# Altium schematic sheet 10.RK3568_PowerGND.SchDoc
size 297 x 209 mm; SheetNumber: 1; SheetTotal: 11
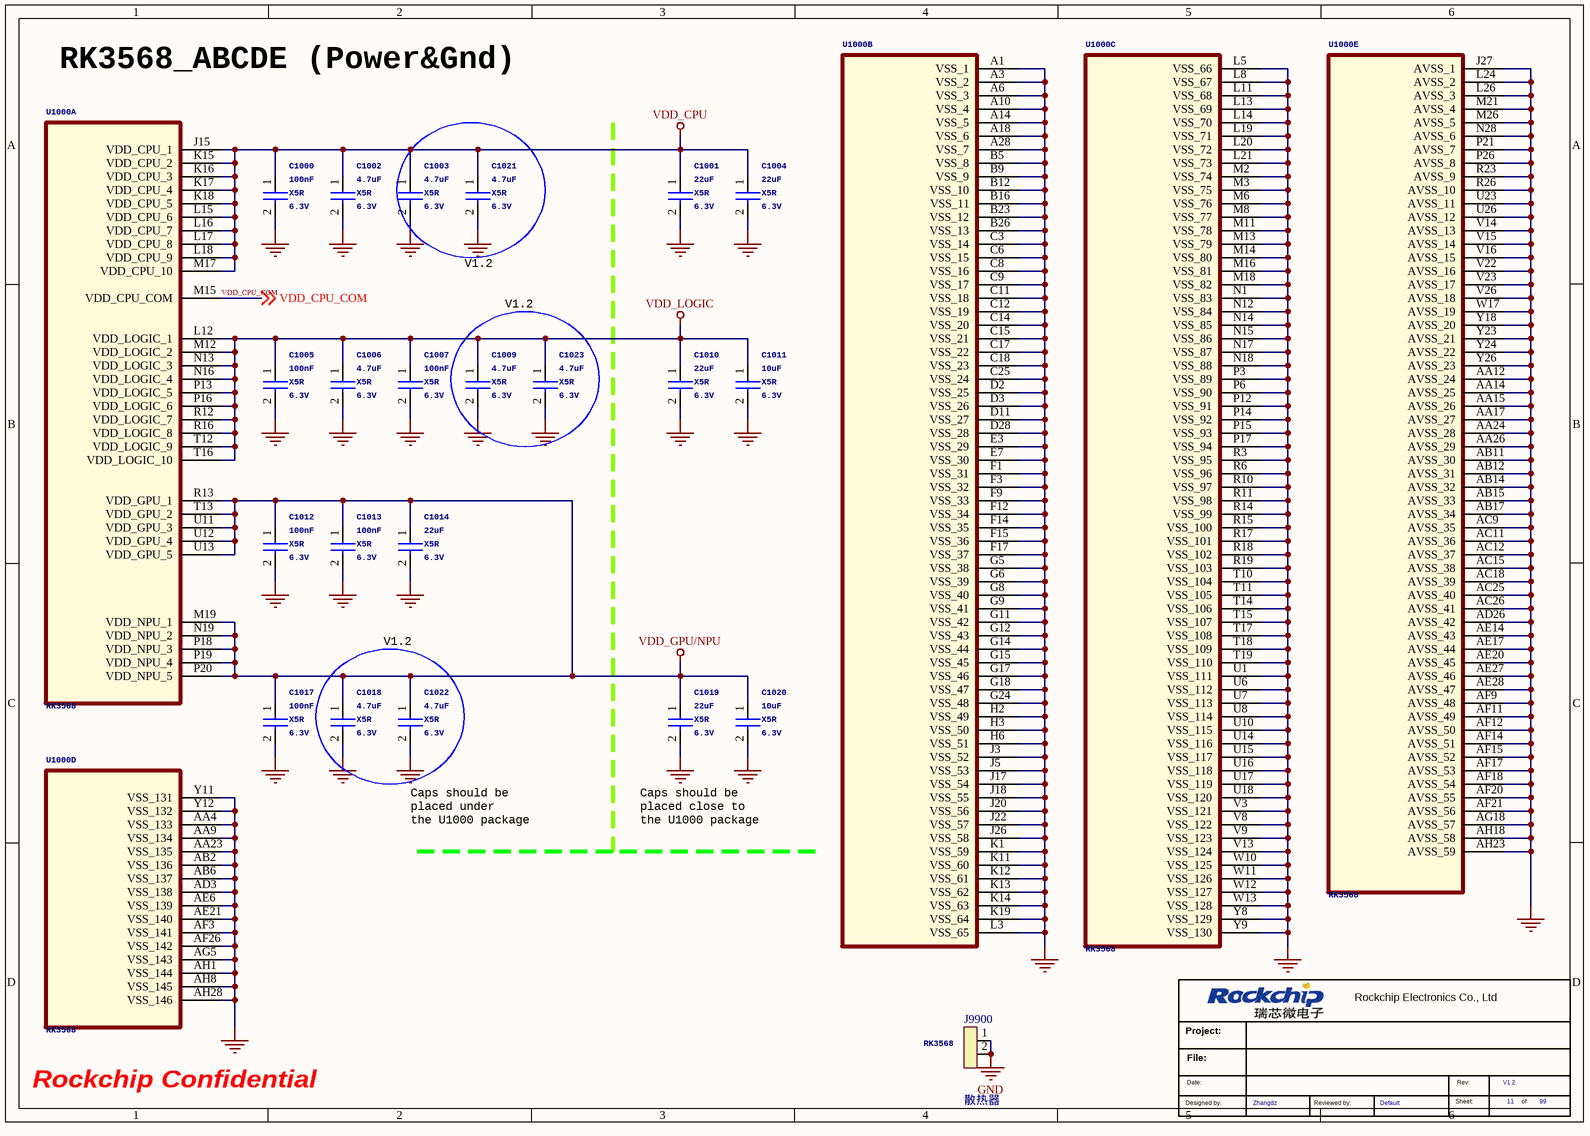
[diagram p0: 10.RK3568_PowerGND.SchDoc]

## Parts
*  Schematic Page Count: 99  Schematic Page Number: 11  Designer: Zhangdz  Revision: V1.2  Check: Default  (hidden comment: Rockchip_new)  (graphical)
C1000  100nF  Voltage: 6.3V  Dielectric: X5R  [C0201]
C1001  22uF  Voltage: 6.3V  Dielectric: X5R  [C0603]
C1002  4.7uF  Voltage: 6.3V  Dielectric: X5R  [C0402]
C1003  4.7uF  Voltage: 6.3V  Dielectric: X5R  [C0402]
C1004  22uF  Voltage: 6.3V  Dielectric: X5R  [C0603]
C1005  100nF  Voltage: 6.3V  Dielectric: X5R  [C0201]
C1006  4.7uF  Voltage: 6.3V  Dielectric: X5R  [C0402]
C1007  100nF  Voltage: 6.3V  Dielectric: X5R  [C0201]
C1009  4.7uF  Voltage: 6.3V  Dielectric: X5R  [C0402]
C1010  22uF  Voltage: 6.3V  Dielectric: X5R  [C0603]
C1011  10uF  Voltage: 6.3V  Dielectric: X5R  [C0603]
C1012  100nF  Voltage: 6.3V  Dielectric: X5R  [C0201]
C1013  100nF  Voltage: 6.3V  Dielectric: X5R  [C0201]
C1014  22uF  Voltage: 6.3V  Dielectric: X5R  [C0603]
C1017  100nF  Voltage: 6.3V  Dielectric: X5R  [C0201]
C1018  4.7uF  Voltage: 6.3V  Dielectric: X5R  [C0402]
C1019  22uF  Voltage: 6.3V  Dielectric: X5R  [C0603]
C1020  10uF  Voltage: 6.3V  Dielectric: X5R  [C0603]
C1021  4.7uF  Voltage: 6.3V  Dielectric: X5R  [C0402]
C1022  4.7uF  Voltage: 6.3V  Dielectric: X5R  [C0402]
C1023  4.7uF  Voltage: 6.3V  Dielectric: X5R  [C0402]
J9900  散热器  [RADIATOR_38RX38RX10R]
U1000  RK3568  [BGA636_19R00X19R00X1R20]  (parts A,B,C,D,E of 23)

## Nets
GND: C1000.2 C1001.2 C1002.2 C1003.2 C1004.2 C1005.2 C1006.2 C1007.2 C1009.2 C1010.2 C1011.2 C1012.2 C1013.2 C1014.2 C1017.2 C1018.2 C1019.2 C1020.2 C1021.2 C1022.2 C1023.2 J9900.1 J9900.2 U1000.A1(VSS_1) U1000.A3(VSS_2) U1000.A6(VSS_3) U1000.A10(VSS_4) U1000.A14(VSS_5) U1000.A18(VSS_6) U1000.A28(VSS_7) U1000.AA4(VSS_133) U1000.AA9(VSS_134) U1000.AA12(AVSS_24) U1000.AA14(AVSS_25) U1000.AA15(AVSS_26) U1000.AA17(AVSS_27) U1000.AA23(VSS_135) U1000.AA24(AVSS_28) U1000.AA26(AVSS_29) U1000.AB2(VSS_136) U1000.AB6(VSS_137) U1000.AB11(AVSS_30) U1000.AB12(AVSS_31) U1000.AB14(AVSS_32) U1000.AB15(AVSS_33) U1000.AB17(AVSS_34) U1000.AC9(AVSS_35) U1000.AC11(AVSS_36) U1000.AC12(AVSS_37) U1000.AC15(AVSS_38) U1000.AC18(AVSS_39) U1000.AC25(AVSS_40) U1000.AC26(AVSS_41) U1000.AD3(VSS_138) U1000.AD26(AVSS_42) U1000.AE6(VSS_139) U1000.AE14(AVSS_43) U1000.AE17(AVSS_44) U1000.AE20(AVSS_45) U1000.AE21(VSS_140) U1000.AE27(AVSS_46) U1000.AE28(AVSS_47) U1000.AF3(VSS_141) U1000.AF9(AVSS_48) U1000.AF11(AVSS_49) U1000.AF12(AVSS_50) U1000.AF14(AVSS_51) U1000.AF15(AVSS_52) U1000.AF17(AVSS_53) U1000.AF18(AVSS_54) U1000.AF20(AVSS_55) U1000.AF21(AVSS_56) U1000.AF26(VSS_142) U1000.AG5(VSS_143) U1000.AG18(AVSS_57) U1000.AH1(VSS_144) U1000.AH8(VSS_145) U1000.AH18(AVSS_58) U1000.AH23(AVSS_59) U1000.AH28(VSS_146) U1000.B5(VSS_8) U1000.B9(VSS_9) U1000.B12(VSS_10) U1000.B16(VSS_11) U1000.B23(VSS_12) U1000.B26(VSS_13) U1000.C3(VSS_14) U1000.C6(VSS_15) U1000.C8(VSS_16) U1000.C9(VSS_17) U1000.C11(VSS_18) U1000.C12(VSS_19) U1000.C14(VSS_20) U1000.C15(VSS_21) U1000.C17(VSS_22) U1000.C18(VSS_23) U1000.C25(VSS_24) U1000.D2(VSS_25) U1000.D3(VSS_26) U1000.D11(VSS_27) U1000.D28(VSS_28) U1000.E3(VSS_29) U1000.E7(VSS_30) U1000.F1(VSS_31) U1000.F3(VSS_32) U1000.F9(VSS_33) U1000.F12(VSS_34) U1000.F14(VSS_35) U1000.F15(VSS_36) U1000.F17(VSS_37) U1000.G5(VSS_38) U1000.G6(VSS_39) U1000.G8(VSS_40) U1000.G9(VSS_41) U1000.G11(VSS_42) U1000.G12(VSS_43) U1000.G14(VSS_44) U1000.G15(VSS_45) U1000.G17(VSS_46) U1000.G18(VSS_47) U1000.G24(VSS_48) U1000.H2(VSS_49) U1000.H3(VSS_50) U1000.H6(VSS_51) U1000.J3(VSS_52) U1000.J5(VSS_53) U1000.J17(VSS_54) U1000.J18(VSS_55) U1000.J20(VSS_56) U1000.J22(VSS_57) U1000.J26(VSS_58) U1000.J27(AVSS_1) U1000.K1(VSS_59) U1000.K11(VSS_60) U1000.K12(VSS_61) U1000.K13(VSS_62) U1000.K14(VSS_63) U1000.K19(VSS_64) U1000.L3(VSS_65) U1000.L5(VSS_66) U1000.L8(VSS_67) U1000.L11(VSS_68) U1000.L13(VSS_69) U1000.L14(VSS_70) U1000.L19(VSS_71) U1000.L20(VSS_72) U1000.L21(VSS_73) U1000.L24(AVSS_2) U1000.L26(AVSS_3) U1000.M2(VSS_74) U1000.M3(VSS_75) U1000.M6(VSS_76) U1000.M8(VSS_77) U1000.M11(VSS_78) U1000.M13(VSS_79) U1000.M14(VSS_80) U1000.M16(VSS_81) U1000.M18(VSS_82) U1000.M21(AVSS_4) U1000.M26(AVSS_5) U1000.N1(VSS_83) U1000.N12(VSS_84) U1000.N14(VSS_85) U1000.N15(VSS_86) U1000.N17(VSS_87) U1000.N18(VSS_88) U1000.N28(AVSS_6) U1000.P3(VSS_89) U1000.P6(VSS_90) U1000.P12(VSS_91) U1000.P14(VSS_92) U1000.P15(VSS_93) U1000.P17(VSS_94) U1000.P21(AVSS_7) U1000.P26(AVSS_8) U1000.R3(VSS_95) U1000.R6(VSS_96) U1000.R10(VSS_97) U1000.R11(VSS_98) U1000.R14(VSS_99) U1000.R15(VSS_100) U1000.R17(VSS_101) U1000.R18(VSS_102) U1000.R19(VSS_103) U1000.R23(AVSS_9) U1000.R26(AVSS_10) U1000.T10(VSS_104) U1000.T11(VSS_105) U1000.T14(VSS_106) U1000.T15(VSS_107) U1000.T17(VSS_108) U1000.T18(VSS_109) U1000.T19(VSS_110) U1000.U1(VSS_111) U1000.U6(VSS_112) U1000.U7(VSS_113) U1000.U8(VSS_114) U1000.U10(VSS_115) U1000.U14(VSS_116) U1000.U15(VSS_117) U1000.U16(VSS_118) U1000.U17(VSS_119) U1000.U18(VSS_120) U1000.U23(AVSS_11) U1000.U26(AVSS_12) U1000.V3(VSS_121) U1000.V8(VSS_122) U1000.V9(VSS_123) U1000.V13(VSS_124) U1000.V14(AVSS_13) U1000.V15(AVSS_14) U1000.V16(AVSS_15) U1000.V22(AVSS_16) U1000.V23(AVSS_17) U1000.V26(AVSS_18) U1000.W10(VSS_125) U1000.W11(VSS_126) U1000.W12(VSS_127) U1000.W13(VSS_128) U1000.W17(AVSS_19) U1000.Y8(VSS_129) U1000.Y9(VSS_130) U1000.Y11(VSS_131) U1000.Y12(VSS_132) U1000.Y18(AVSS_20) U1000.Y23(AVSS_21) U1000.Y24(AVSS_22) U1000.Y26(AVSS_23)
VDD_CPU: C1000.1 C1001.1 C1002.1 C1003.1 C1004.1 C1021.1 U1000.J15(VDD_CPU_1) U1000.K15(VDD_CPU_2) U1000.K16(VDD_CPU_3) U1000.K17(VDD_CPU_4) U1000.K18(VDD_CPU_5) U1000.L15(VDD_CPU_6) U1000.L16(VDD_CPU_7) U1000.L17(VDD_CPU_8) U1000.L18(VDD_CPU_9) U1000.M17(VDD_CPU_10)
VDD_GPU/NPU: C1012.1 C1013.1 C1014.1 C1017.1 C1018.1 C1019.1 C1020.1 C1022.1 U1000.M19(VDD_NPU_1) U1000.N19(VDD_NPU_2) U1000.P18(VDD_NPU_3) U1000.P19(VDD_NPU_4) U1000.P20(VDD_NPU_5) U1000.R13(VDD_GPU_1) U1000.T13(VDD_GPU_2) U1000.U11(VDD_GPU_3) U1000.U12(VDD_GPU_4) U1000.U13(VDD_GPU_5)
VDD_LOGIC: C1005.1 C1006.1 C1007.1 C1009.1 C1010.1 C1011.1 C1023.1 U1000.L12(VDD_LOGIC_1) U1000.M12(VDD_LOGIC_2) U1000.N13(VDD_LOGIC_3) U1000.N16(VDD_LOGIC_4) U1000.P13(VDD_LOGIC_5) U1000.P16(VDD_LOGIC_6) U1000.R12(VDD_LOGIC_7) U1000.R16(VDD_LOGIC_8) U1000.T12(VDD_LOGIC_9) U1000.T16(VDD_LOGIC_10)
VDD_CPU_COM: U1000.M15(VDD_CPU_COM) ; off-sheet VDD_CPU_COM

## Notes on the sheet
- RK3568_ABCDE (Power&Gnd)
- V1.2
- Caps should be
  placed under
  the U1000 package
- Caps should be
  placed close to
  the U1000 package
- Rockchip Confidential
- (in symbol Rockchip_new) Rockchip Electronics Co., Ltd; Project:; File:; Date:; Rev:; Designed by:; Reviewed by:; Sheet:; of

## Library data of the parts
* = Rockchip_new: Page Number: 7; Page Count: 37; Revcode: V1.2
C1000 C1005 C1007 C1013 = CAP NP: cap,100.00nF,+/-10%,6.3V,X5R,C0201; Manufacturer: TDK; Number: 37; RK PN: C0603X5R0J104K030BC; Priority: A; Tolerance: 10%; Part Type: C0201; Manufacturer PN: C0603X5R0J104K030BC; C_Voltage: 6.3V; Created by: JJJ
C1001 C1004 = CAP NP: cap,22.00uF,+/-20%,6.3V,X5R,C0603; Manufacturer: TDK; RK PN: C1608X5R0J226M080AC; Priority: A; Tolerance: 20%; Part Type: C0603; C_Voltage: 6.3V; Manufacturer PN: C1608X5R0J226M080AC; Created by: JJJ
C1002 C1003 C1006 C1009 C1021 C1023 = CAP NP: cap,4.70uF,+/-10%,6.3V,X5R,C0402; Manufacturer PN: C1005X5R0J475K050BC; Manufacturer: TDK; Tolerance: 10%; Priority: A; Created by: JJJ; C_Voltage: 6.3V; Part Type: C0402; RK PN: C1005X5R0J475K050BC
C1010 C1014 C1019 = CAP NP: cap,22.00uF,+/-20%,6.3V,X5R,C0603; Manufacturer PN: C1608X5R0J226M080AC; Manufacturer: TDK; Tolerance: 20%; Priority: A; Created by: JJJ; C_Voltage: 6.3V; Part Type: C0603; RK PN: C1608X5R0J226M080AC
C1011 C1020 = CAP NP: cap,10.00uF,+/-10%,6.3V,X5R,C0603; Manufacturer PN: C1608X5R0J106K080AB; Manufacturer: TDK; Tolerance: 10%; Priority: A; Created by: JJJ; C_Voltage: 6.3V; Part Type: C0603; RK PN: C1608X5R0J106K080AB
C1012 C1017 = CAP NP: cap,100.00nF,+/-10%,6.3V,X5R,C0201; Manufacturer PN: C0603X5R0J104K030BC; Manufacturer: TDK; Tolerance: 10%; Priority: A; Number: 37; Created by: JJJ; C_Voltage: 6.3V; Part Type: C0201; RK PN: C0603X5R0J104K030BC
C1018 C1022 = CAP NP: cap,4.70uF,+/-10%,6.3V,X5R,C0402; Manufacturer: TDK; RK PN: C1005X5R0J475K050BC; Priority: A; Tolerance: 10%; Part Type: C0402; C_Voltage: 6.3V; Manufacturer PN: C1005X5R0J475K050BC; Created by: JJJ
J9900 = CON2: SOCKET
U1000 = SOC_RK3568: ROCKCHIP SOC; Manufacturer: Rockchip (瑞芯微); SPLIT_INST: TRUE; SWAP_INFO: (S1+S2+S3+S4+S5+S6+S7+S8+S9+S10+S11+S12+S13+S14+S15+S16+S17+S18+S19+S20+S21+S22+S23); Priority: A; RK PN: RK3568; Part Type: SOC; Manufacturer PN: RK3568; Created by: JJJ